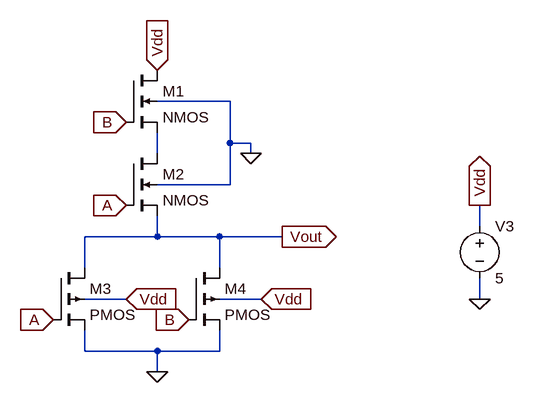
[diagram p0: schematic AND_gate (2).asc]
AND_gate (2).asc, the LTspice schematic file:
Version 4
SHEET 1 1008 680
WIRE 64 -160 -48 -160
WIRE 64 -96 64 -160
WIRE 96 -96 64 -96
WIRE -48 -80 -48 -112
WIRE 96 -80 96 -96
WIRE 64 -32 64 -96
WIRE 64 -32 -48 -32
WIRE 448 32 448 0
WIRE -48 48 -48 16
WIRE -48 48 -160 48
WIRE 48 48 -48 48
WIRE 144 48 48 48
WIRE -160 96 -160 48
WIRE 48 96 48 48
WIRE -96 144 -160 144
WIRE 112 144 48 144
WIRE 448 144 448 112
WIRE -160 224 -160 192
WIRE -48 224 -160 224
WIRE 48 224 48 192
WIRE 48 224 -48 224
WIRE -48 256 -48 224
FLAG 448 0 Vdd
IOPIN 448 0 Out
FLAG -48 -208 Vdd
IOPIN -48 -208 In
FLAG -48 256 0
FLAG -96 0 A
IOPIN -96 0 In
FLAG -208 176 A
IOPIN -208 176 In
FLAG 0 176 B
IOPIN 0 176 In
FLAG -96 -128 B
IOPIN -96 -128 In
FLAG 144 48 Vout
IOPIN 144 48 Out
FLAG 96 -80 0
FLAG -96 144 Vdd
IOPIN -96 144 In
FLAG 112 144 Vdd
IOPIN 112 144 In
FLAG 448 144 0
SYMBOL voltage 448 16 R0
WINDOW 123 0 0 Left 0
WINDOW 39 0 0 Left 0
SYMATTR InstName V3
SYMATTR Value 5
SYMBOL nmos4 -96 -208 R0
SYMATTR InstName M1
SYMBOL nmos4 -96 -80 R0
SYMATTR InstName M2
SYMBOL pmos4 -208 96 R0
SYMATTR InstName M3
SYMBOL pmos4 0 96 R0
SYMATTR InstName M4

The netlist it stands for:
* AND_gate (2).asc
V3 Vdd 0 5
M1 Vdd B N001 0 NMOS
M2 N001 A Vout 0 NMOS
M3 Vout A 0 Vdd PMOS
M4 Vout B 0 Vdd PMOS
.model NMOS NMOS
.model PMOS PMOS
.lib standard.mos
.backanno
.end